# EAGLE design BOTCPCB_IXYS (EAGLE 9.6.2)
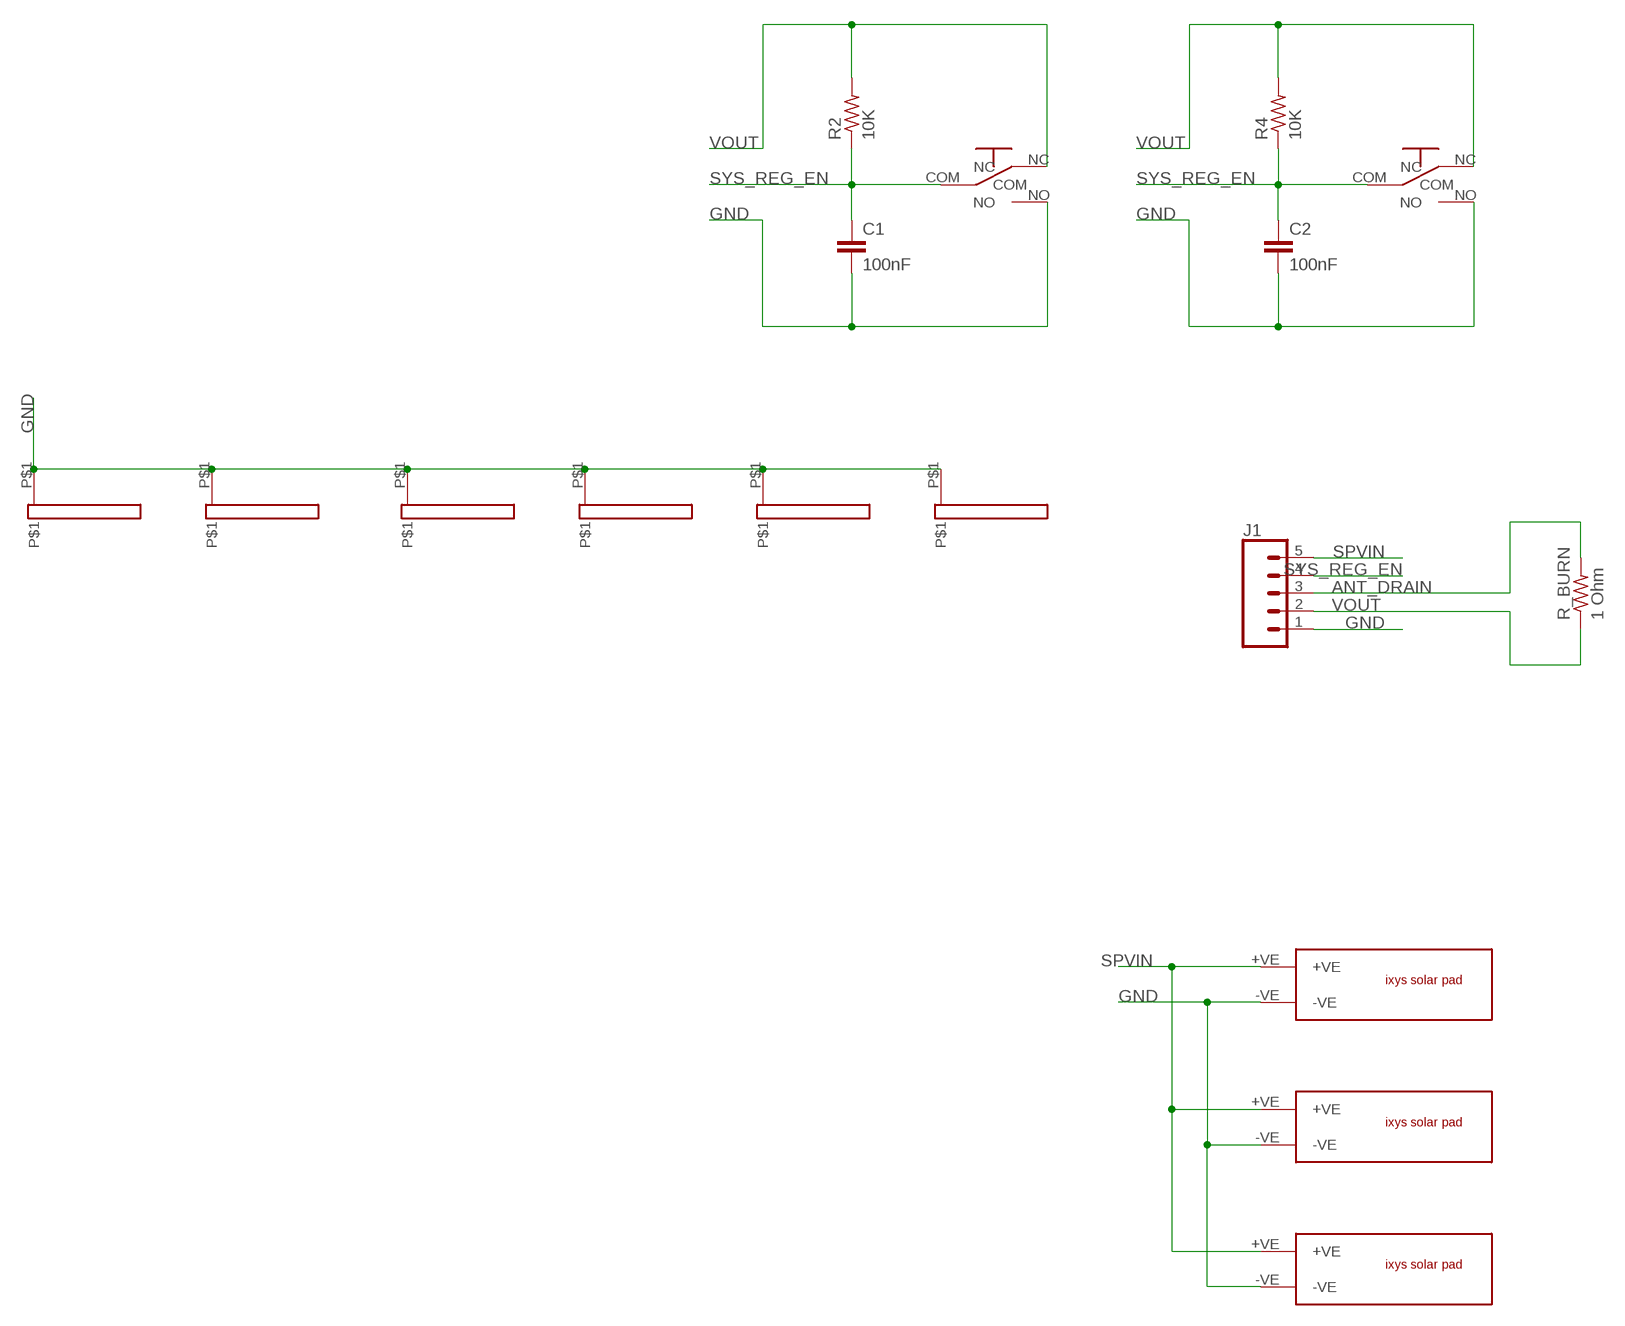
[diagram p0: schematic, sheet 1]

## Parts
C1  100nF  C-EU025-024X044  [C025-024X044]
C2  100nF  C-EU025-024X044  [C025-024X044]
J1  CONN_05NO_SILK  [1X05_NO_SILK]
R2  10K  R-US_0204/5  [0204/5]
R4  10K  R-US_0204/5  [0204/5]
R_BURN  1 Ohm  R-US_0204/5  [0204/5]
U$1  16X2  [16X2]
U$2  16X2  [16X2]
U$3  OMRON-D2FA  [OMRON-D2F-A]
U$4  16X2  [16X2]
U$5  16X2  [16X2]
U$6  OMRON-D2FA  [OMRON-D2F-A]
U$7  16X2  [16X2]
U$8  16X2  [16X2]
U$9  IXYS  [IXYS]
U$11  IXYS  [IXYS]
U$12  IXYS  [IXYS]

## Nets
ANT_DRAIN: J1.3 R_BURN.2
GND [vcc]: C1.2 C2.2 J1.1 U$1.P$1 U$2.P$1 U$3.NO U$4.P$1 U$5.P$1 U$6.NO U$7.P$1 U$8.P$1 U$9.-VE U$11.-VE U$12.-VE
SPVIN: J1.5 U$9.+VE U$11.+VE U$12.+VE
SYS_REG_EN: C1.1 C2.1 J1.4 R2.1 R4.1 U$3.COM U$6.COM
VOUT: J1.2 R2.2 R4.2 R_BURN.1 U$3.NC U$6.NC

## Library data of the parts
C1 C2 = rcl:C-EU: CAPACITOR, European symbol; SPICEPREFIX: C
J1 = SparkFun-Connectors:CONN_05: Multi connection point. Often used as Generic Header-pin footprint for 0.1 inch spaced/style header connections On any of the 0.1 inch spaced packages, you can populate with these: Break Away Headers - Straight <https://www.sparkfun.com/products/116> (PRT-00116) Break Away Male Headers - Right Angle <https://www.sparkfun.com/products/553> (PRT-00553) Female Headers <https://www.sparkfun.com/products/115> (PRT-00115) Break Away Headers - Machine Pin <https://www.sparkfun.com/products/117> (PRT-00117) Break Away Female Headers - Swiss Machine Pin <https://www.sparkfun.com/products/743> (PRT-00743) For SCREWTERMINALS and SPRING TERMINALS visit here: Screw Terimnals on SparkFun.com <https://www.sparkfun.com/search/results?term=Screw+Terminals> (5mm/3.5mm/2.54mm spacing) This device is also useful as a general connection point to wire up your design to another part of your project. Our various solder wires solder well into these plated through hole pads. Hook-Up Wire - Assortment (Stranded, 22 AWG) <https://www.sparkfun.com/products/11375> (PRT-11375) Hook-Up Wire - Assortment (Solid Core, 22 AWG) <https://www.sparkfun.com/products/11367> (PRT-11367) View the entire wire category on our website here <https://www.sparkfun.com/categories/141> Special notes: Molex polarized connector foot print use with SKU : PRT-08231 with associated crimp pins and housings. 1MM SMD Version SKU: PRT-10208
R2 R4 R_BURN = rcl:R-US_: RESISTOR, American symbol; SPICEPREFIX: R
U$1 U$2 U$4 U$5 U$7 U$8 = 16x2PAD:16X2: Pad for 90 degree solder
U$3 U$6 = reprap:OMRON-D2F
U$9 U$11 U$12 = ixys:IXYS

## Net classes
1 vcc: width 0.254 mm

## Board
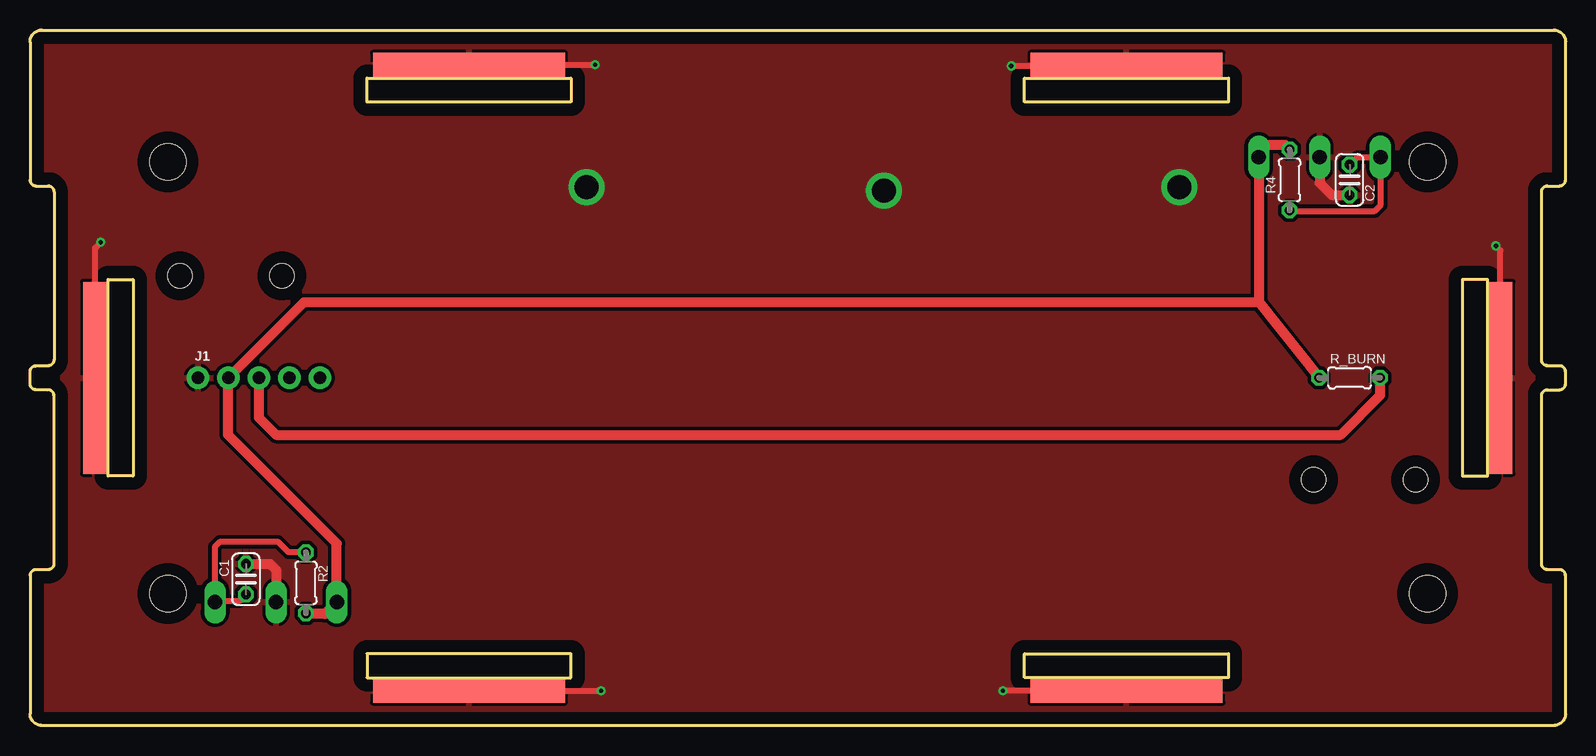
[diagram p1: board, top side]
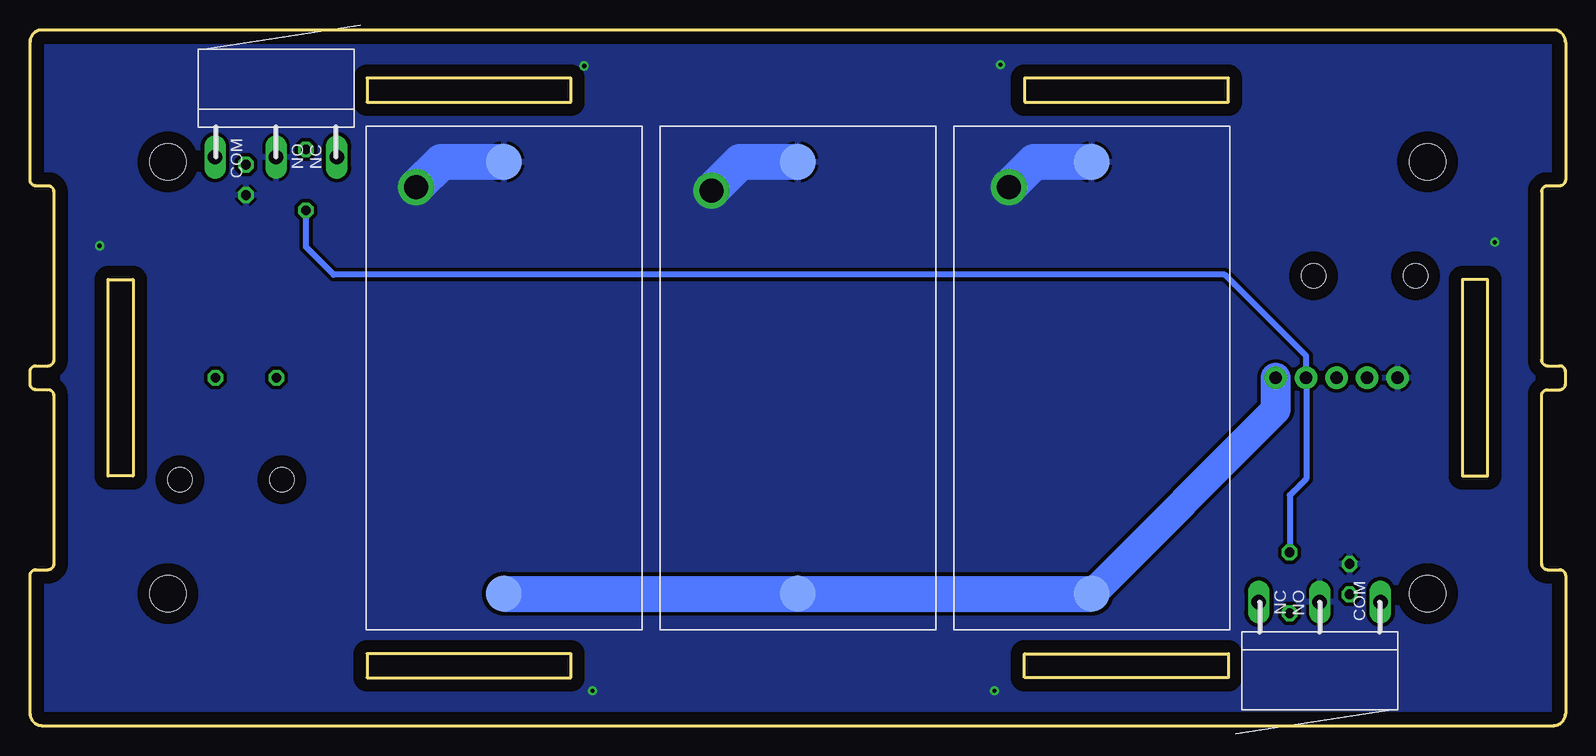
[diagram p2: board, bottom side, seen from below]

Size 128 x 58 mm. Coordinates in mm from the lower left corner, seen from the top.
Outline: 128,1 128,12.5 arc90 127.5,13 126.5,13 arc-90 126,13.5 126,27.5 arc-90 126.5,28 127.5,28 arc90 128,28.5 128,29.5 arc90 127.5,30 126.5,30 arc-90 126,30.5 126,44.5 arc-90 126.5,45 127.5,45 arc90 128,45.5 128,57 arc90 127,58 1,58 arc90 0,57 0,45.5 arc90 0.5,45 1.5,45 arc-90 2,44.5 2,30.5 arc-90 1.5,30 0.5,30 arc90 0,29.5 0,28.5 arc90 0.5,28 1.5,28 arc-90 2,27.5 2,13.5 arc-90 1.5,13 0.5,13 arc90 0,12.5 0,1 arc90 1,0 127,0 arc90 128,1
Outline: 99.9,52 82.9,52 82.9,54 99.9,54 99.9,52
Outline: 99.9,4 82.9,4 82.9,6 99.9,6 99.9,4
Outline: 28.1,4 45.1,4 45.1,6 28.1,6 28.1,4
Outline: 28.1,54 45.1,54 45.1,52 28.1,52 28.1,54
Outline: 119.4,37.2 119.4,20.8 121.5,20.8 121.5,37.2 119.4,37.2
Outline: 8.6,37.2 8.6,20.8 6.5,20.8 6.5,37.2 8.6,37.2
Copper layers (1*16): Top 0.035mm / dielectric 1.5mm / Bottom 0.035mm
Design rules "default *": minimum track width 6mil, minimum drill 0.35mm, track to track 12mil, track to pad 6mil, pad to pad 6mil, via to via 6mil, smd to smd 6mil, copper to edge 40mil, drill to drill 6mil, minimum pad ring 10mil, minimum via ring 8mil, stop-mask expansion 4mil, vias tented up to drill 0mil, thermal gap 10mil
Holes 3 mm at 11.5,47 11.5,11 116.5,11 116.5,47
Holes 2 mm at 21,37.5 12.5,37.5 107,20.5 115.5,20.5

### Footprints (pad centres in the part's own frame; a part is rotated, then mirrored left to right if it is on the bottom)
C025-024X044 = drill 0.813 octagon: 1 -1.27,0; 2 1.27,0
1X05_NO_SILK = drill 1.016 pad 1.88: 1 0,0; 2 2.54,0; 3 5.08,0; 4 7.62,0; 5 10.16,0
0204/5 = drill 0.813 octagon: 1 -2.54,0; 2 2.54,0
16X2 = smd 16 x 2: P$1 0,0
OMRON-D2F-A = drill 1.2 long: COM -5.08,0; NC 5.08,0; NO 0,0
IXYS = smd 3 x 3: +VE 3,11.5; -VE 39,11.5

### Placement (x,y rotation side)
C1  18,12.2 90 top
C2  110,45.5 270 top
J1  14,29 0 top
R2  23,11.9 270 top
R4  105,45.5 90 top
R_BURN  110,29 0 top
U$1  122.57,28.99 270 top
U$2  5.43,28.99 270 top
U$3  20.5,10.3 180 bottom
U$4  36.6,2.9 0 top
U$5  36.6,55.1 0 top
U$6  107.5,47.4 0 bottom
U$7  91.4,2.9 0 top
U$8  91.4,55.1 0 top
U$9  52.5,8 90 bottom
U$11  28,8 90 bottom
U$12  77,8 90 bottom

### Tracks (layer width: path | path; a pad name or v marks a point on that pad's centre or on a via)
ANT_DRAIN
  Top 0.813: J1.3 19.08,25.67 20.5,24.25 109.25,24.25 112.54,27.54 R_BURN.2
GND  (via drill 0.35, 2)
  Top 0.508: U$5.P$1 v47.1,55.1 | U$8.P$1 91.3,55 v81.8,55 | U$1.P$1 122.57,39.63 v122.2,40 | U$7.P$1 v81.1,2.9 | U$4.P$1 v47.6,2.9 | U$2.P$1 5.43,39.83 v5.9,40.3
  Top 0.813: U$6.NO 107.5,45.25 108.52,44.23 C2.2 | C1.2 20.03,13.47 20.5,13 U$3.NO
  Bottom 3: U$11.-VE 44.3,47 v46.4,44.9 | U$9.-VE 68.8,47 v71.2,44.6 | U$12.-VE 93.7,47 v95.8,44.9
  pour Bottom: -9.5,52.5 -9.5,55.7 2.3,67.5 124.9,67.5 134.4,58 134.4,-0.4 126.6,-8.2 124.4,-10.4 2.3,-10.4 -9.5,1.4
  pour Top: -9.5,55.3 2.7,67.5 124.9,67.5 134.4,58 134.4,-0.5 124.5,-10.4 2.3,-10.4 -9.5,1.4
SPVIN
  Bottom 2.5: U$11.+VE 24.16,26.34 J1.5
  Bottom 3: U$12.+VE U$9.+VE U$11.+VE
SYS_REG_EN
  Top 0.152: 15.54,10.36 U$3.COM
  Top 0.508: C1.1 17.43,10.36 15.54,10.36 15.4,10.51 15.4,14.9 15.8,15.3 20.7,15.3 21.56,14.44 R2.1 | C2.1 110.63,47.4 U$6.COM 112.6,47.4 112.6,43.4 112.1,42.9 105.06,42.9 R4.1
  Bottom 0.508: R2.1 23,19.2 21.62,20.58 J1.4 21.62,30.82 28.4,37.6 102.7,37.6 105,39.9 R4.1
VOUT
  Top 0.508: 102.42,48.4 U$6.NC | R2.2 23.06,9.3 | 16.5,28.96 J1.2
  Top 0.813: R4.2 104.64,48.4 102.42,48.4 | U$6.NC 102.42,35.31 | 102.42,35.31 R_BURN.1 | 23.06,9.3 24.58,9.3 U$3.NC 25.58,15.17 16.5,24.25 16.5,28.96 | J1.2 22.85,35.31 102.42,35.31